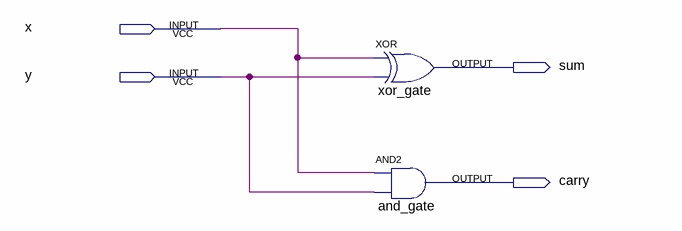
[diagram p0: schematic sheet]
// Quartus schematic 1_getting_started.bdf as structural Verilog: 2 symbols, 4 pins
module \1_getting_started  (
  input  x,
  input  y,
  output sum,
  output carry
);

  xor xor_gate (sum, x, y);
  and and_gate (carry, x, y);
endmodule
